# EAGLE design pd15 (EAGLE 7.2.0)
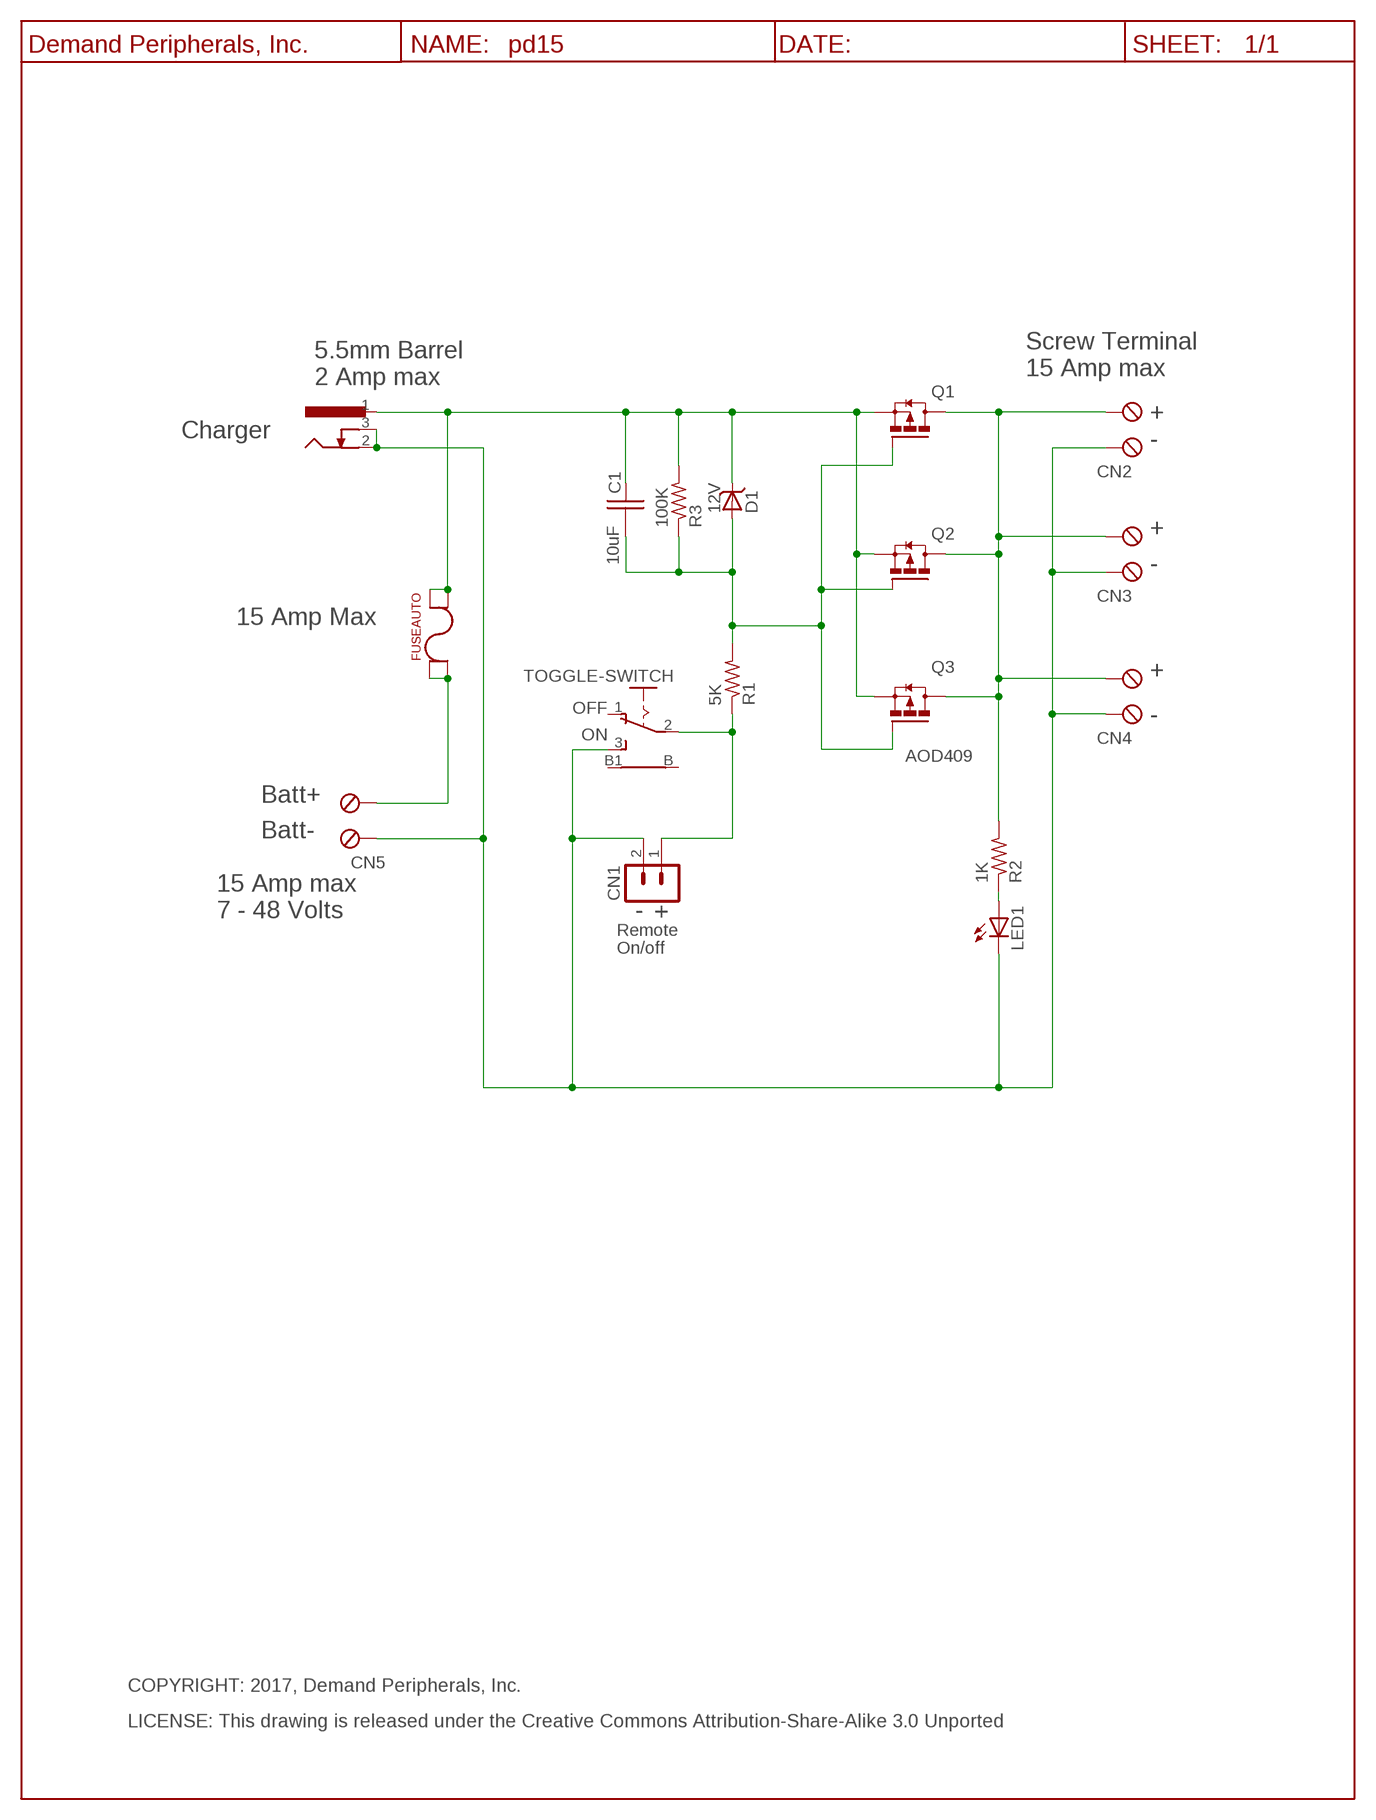
[diagram p0: schematic, sheet 1]

## Parts
C1  10uF  C10UF35V_C0805  [C0805]
CN1  HDR-2X1-LCK  [HDR-2X1]
CN2  TBLK-5.08-X2  [TBLK-5.08-X2]
CN3  TBLK-5.08-X2  [TBLK-5.08-X2]
CN4  TBLK-5.08-X2  [TBLK-5.08-X2]
CN5  TBLK-5.08-X2  [TBLK-5.08-X2]
D1  12V  BZT52C12  [SOD123]
FUSE  FUSEAUTO  FUSE-KS3557  [KS3557-10]
J1  Barrel-5.5mm  DC-BARREL-JACK--55MM  [DC-BARREL-JACK-55MM]
LED1  LED-5MM-GRN  [LED5MM]
Q1  FET_DPAK_P  AOD409  [DPACK_TO-252]
Q2  FET_DPAK_P  AOD409  [DPACK_TO-252]
Q3  AOD409  [DPACK_TO-252]
R1  5K  R4.99K_R0603  [R0603]
R2  1K  R1K_R0603  [R0603]
R3  100K  R100K_R0603  [R0603]
TOGGLE-SWITCH  B12EH  TOGGLE_SPDT_PC  [TOGGLE_SPDT_PC]
U$1  DP_FRAME_P  [LETTER_P]

## Nets
BATT+: CN5.2(KL1) FUSE.LS@1(LS) FUSE.LS@2(LS)
FUSE+: C1.1 D1.C FUSE.RS@3(RS) FUSE.RS@4(RS) J1.1 Q1.3(S) Q2.3(S) Q3.3(S) R3.2
GND: CN1.2 CN2.1(KL) CN3.1(KL) CN4.1(KL) CN5.1(KL) J1.2 J1.3 LED1.C TOGGLE-SWITCH.3(S)
N$1: LED1.A R2.1
N$10: C1.2 D1.A Q1.1(G) Q2.1(G) Q3.1(G) R1.2 R3.1
ON+: CN1.1 R1.1 TOGGLE-SWITCH.2(P)
V+: CN2.2(KL1) CN3.2(KL1) CN4.2(KL1) Q1.4(D) Q2.4(D) Q3.4(D) R2.2
Unconnected: TOGGLE-SWITCH.1(O) TOGGLE-SWITCH.B TOGGLE-SWITCH.B1

## Notes on the sheet
- Screw Terminal
- 5.5mm Barrel
- 15 Amp max
- 2 Amp max
- +
- Charger
- -
- +
- -
- 15 Amp Max
- +
- OFF
- -
- ON
- Batt+
- Batt-
- 15 Amp max
- 7 - 48 Volts | - | +
- Remote
- On/off
- COPYRIGHT: 2017, Demand Peripherals, Inc.
- LICENSE: This drawing is released under the Creative Commons Attribution-Share-Alike 3.0 Unported

## Library data of the parts
C1 = dpi-passive:C10UF35V_: 10 uF Capacitor, 35V, X6S; VENDOR: Digikey; VENDOR-PART-NUM: 490-10504-2-ND
CN1 = dpi-conn:HDR-2X1-LCK: 2x1 pin header with friction lock; VENDOR: Mouser; VENDOR-PART-NUM: 571-6404562
CN2-CN5 = dpi-conn:TBLK-5.08-X2: Terminal Block, 5.08mm, x2, screw terminals; VENDOR: Digikey; VENDOR-PART-NUM: ED2609-ND
D1 = dpi-diopto:BZT52C12: BZT52C12 12 volt Zener, 500 mW; VENDOR: Digikey; VENDOR-PART-NUM: BZT52C1213-FDICT-ND
FUSE = dpi-conn:FUSE-KS3557: Automotive fuse holder; VENDOR: Digikey; VENDOR-PART-NUM: 36-3557-10-ND
J1 = dpi-conn:DC-BARREL-JACK--55MM: 5.5 mm DC POWER JACK, CUI PJ-102AH; VENDOR: Digikey; VENDOR-PART-NUM: CP-102AH-ND
LED1 = dpi-diopto:LED-5MM-GRN: Green LED, 5 MM, through-hole; VENDOR: Digikey; VENDOR-PART-NUM: 160-1852-ND
Q1-Q3 = dpi-transic:AOD409: FET P-channel D-PAK w/diode; VENDOR: Digikey; VENDOR-PART-NUM: 785-1103-1-ND
R1 = dpi-passive:R4.99K_: 4.99K Resistor, 1%, 0.1 watt; VENDOR: Digikey; VENDOR-PART-NUM: 311-4.99KHRTR-ND
R2 = dpi-passive:R1K_: 1K Resistor, 1%, 0.1 watt; VENDOR: Digikey; VENDOR-PART-NUM: 311-1.00KHRTR-ND
R3 = dpi-passive:R100K_: 100K Resistor, 1%, 0.1 watt; VENDOR: Digikey; VENDOR-PART-NUM: 311-100KHRTR-ND
TOGGLE-SWITCH = dpi-swsens:TOGGLE_SPDT_PC: SPDT TOGGLE SWITCH; VENDOR: Digikey; VENDOR-PART-NUM: CKN1454-ND
U$1 = DP:DP_FRAME_P: Portrait/Letter Document Frame

## Board
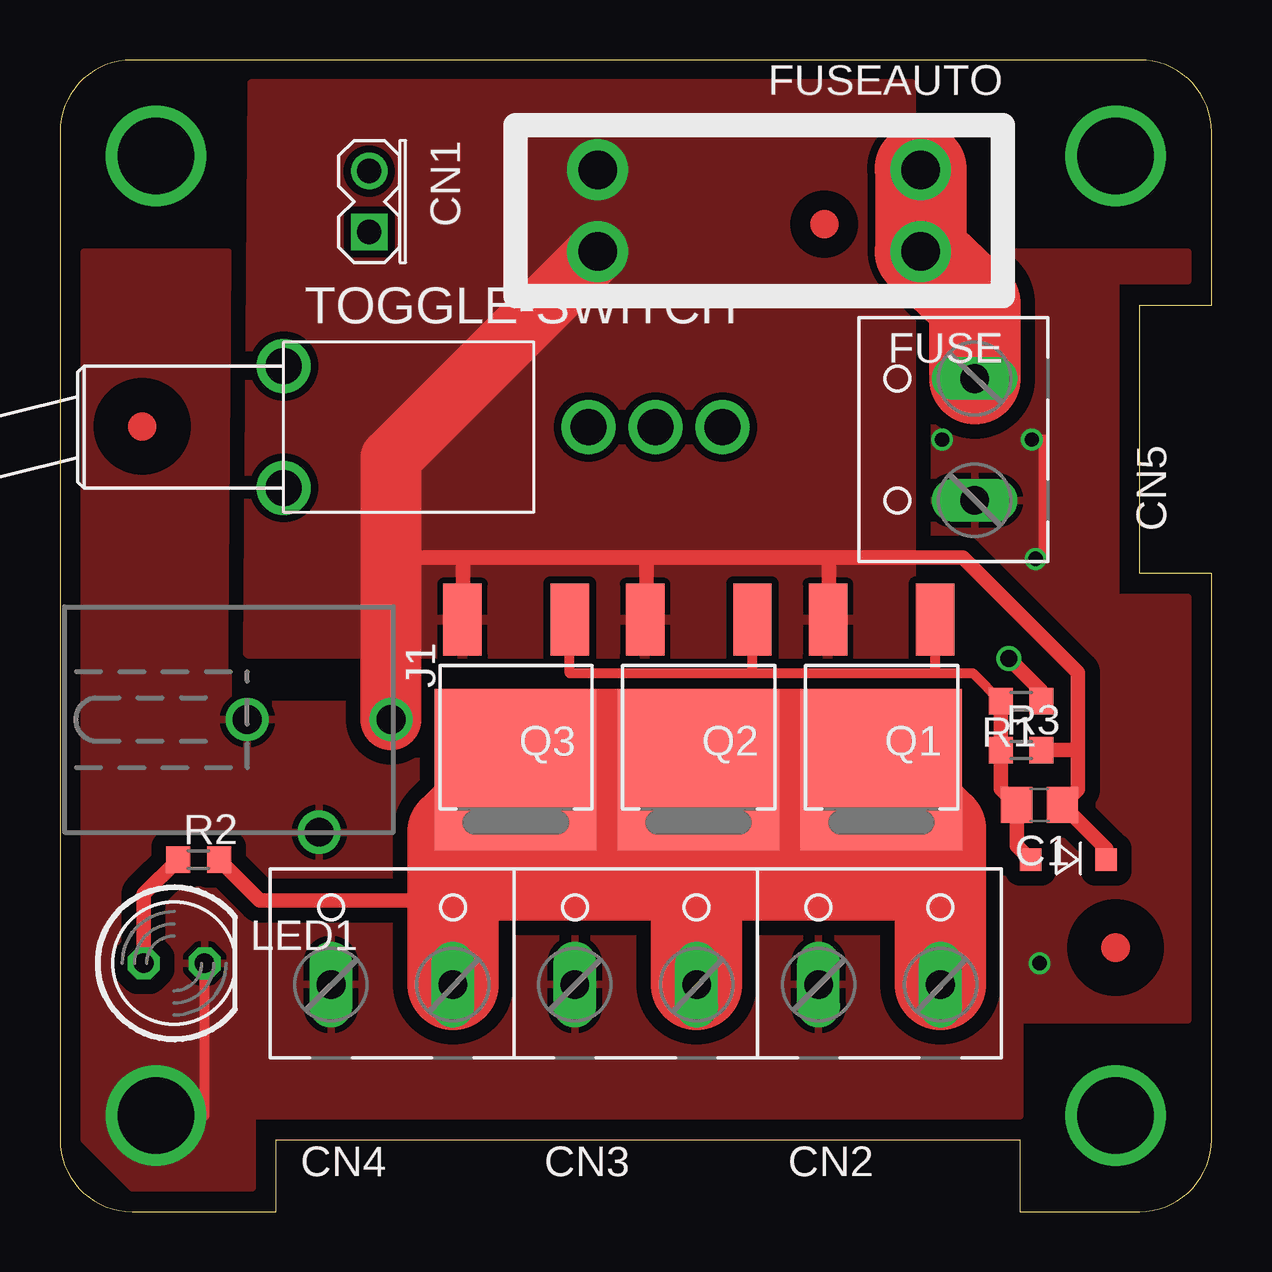
[diagram p1: board, top side]
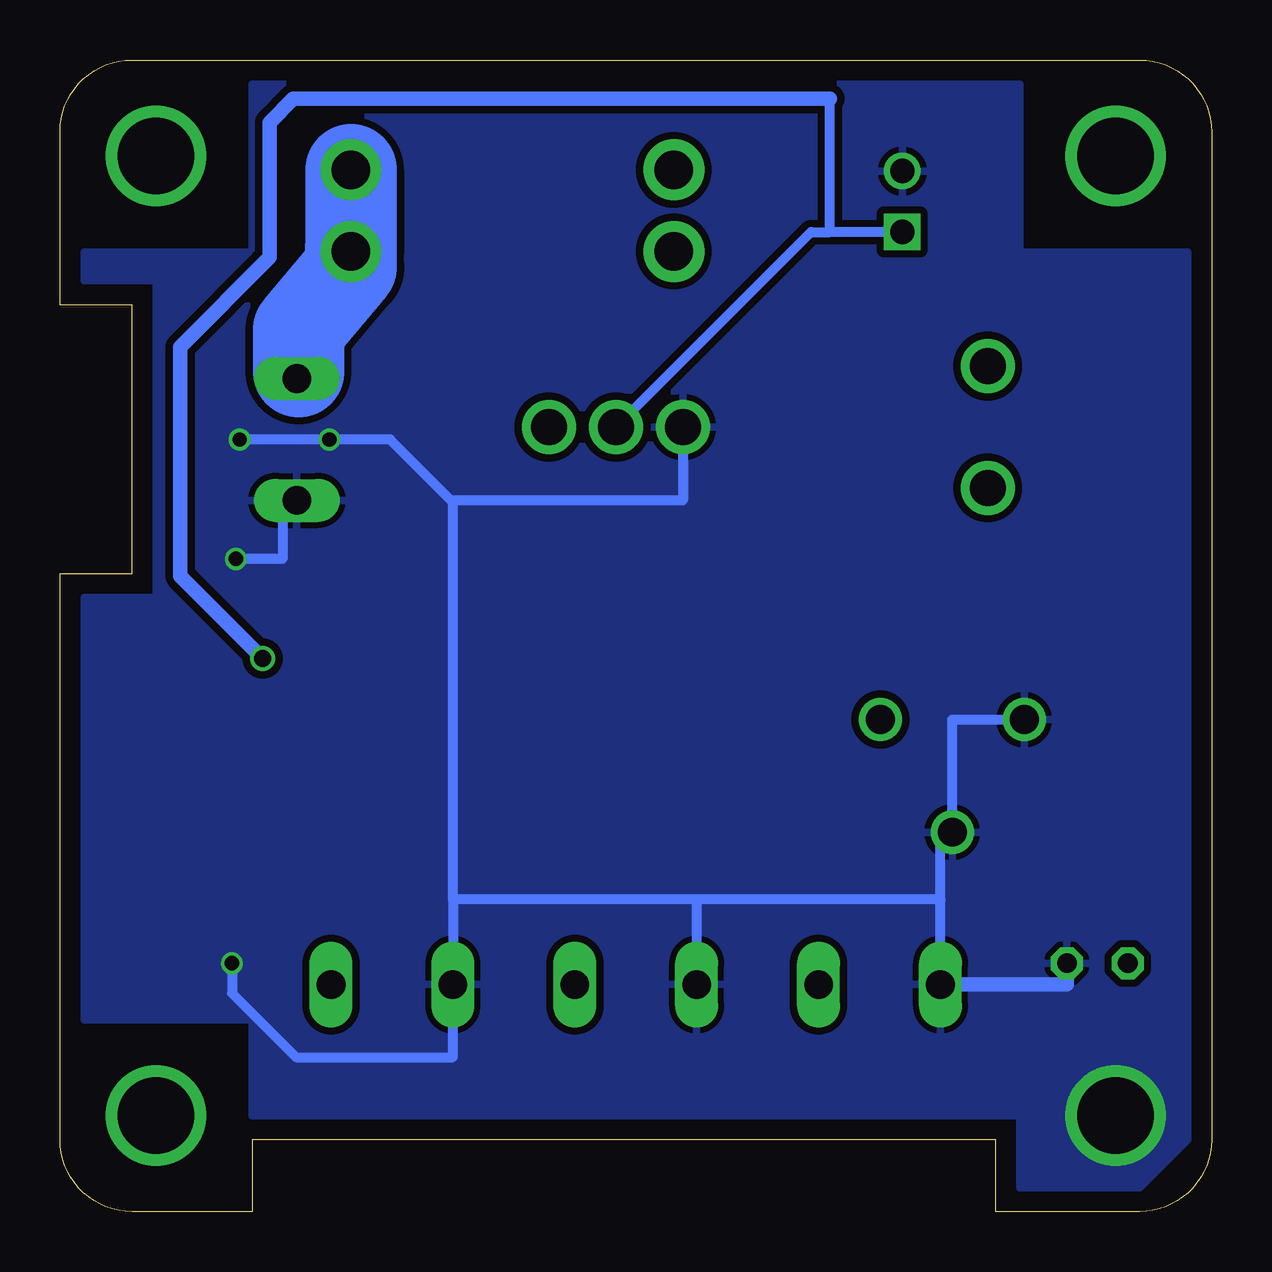
[diagram p2: board, bottom side, seen from below]

Size 48 x 48 mm. Coordinates in mm from the lower left corner, seen from the top.
Outline: 48,37.78 48,45 arc90 45,48 3,48 arc90 0,45 0,3 arc90 3,0 9,0 9,3 40,3 40,0 45,0 arc90 48,3 48,26.6 45,26.6 45,37.78 48,37.78
Copper layers (1*16): Top 0.035mm / dielectric 1.5mm / Bottom 0.035mm
Design rules "Fusion_eagle_rule_v1.1 *": minimum track width 6mil, minimum drill 12mil, track to track 12mil, track to pad 12mil, pad to pad 12mil, via to via 12mil, smd to smd 0mil, copper to edge 20mil, drill to drill 10mil, minimum pad ring 10mil, minimum via ring 6mil, stop-mask expansion 2mil, vias tented up to drill 10mil, thermal gap 10mil

### Footprints (pad centres in the part's own frame; a part is rotated, then mirrored left to right if it is on the bottom)
C0805 = smd 1.3 x 1.5: 1 -0.95,0; 2 0.95,0
HDR-2X1 = drill 1.016 square: 1 1.27,0 | drill 1.016: 2 -1.27,0
TBLK-5.08-X2 = drill 1.194 long: 1 -2.54,-0.127; 2 2.54,-0.127
SOD123 = smd 0.9 x 0.95: A 1.575,0; C -1.575,0
KS3557-10 = drill 1.6 pad 2.54: LS@1 -6.731,-1.702; LS@2 -6.731,1.702; RS@3 6.731,1.702; RS@4 6.731,-1.702
DC-BARREL-JACK-55MM = drill 1.2: 1 0,5.994; 2 0,0; 3 4.699,2.997
LED5MM = drill 0.813 octagon: A -1.27,0; C 1.27,0
DPACK_TO-252 = smd 1.6 x 2.997: 1 -2.261,-4.928; 3 2.21,-4.928 | smd 6.731 x 6.731: 4 0,1.321
R0603 = smd 1 x 1.1: 1 -0.85,0; 2 0.85,0
TOGGLE_SPDT_PC = drill 1.5 pad 1.676: 1 18.288,0; 2 15.494,0; 3 12.7,0 | drill 1.5 pad 1.778: B 0,-2.54; B1 0,2.54

### Placement (x,y rotation side)
C1  40.83,16.95 180 top
CN1  12.89,42.1 270 top
CN2  34.16,9.59 0 top
CN3  24,9.59 0 top
CN4  13.84,9.59 0 top
CN5  38,32.18 90 top
D1  42.03,14.67 180 top
FUSE  29.14,41.72 180 top
J1  7.81,20.51 270 top
LED1  4.76,10.35 0 top
Q1  34.22,19.75 180 top
Q2  26.6,19.75 180 top
Q3  18.98,19.75 180 top
R1  40.07,21.27 180 top
R2  5.78,14.67 0 top
R3  40.07,19.24 0 top
TOGGLE-SWITCH  9.33,32.7 0 top
U$1  -2.35,-2.35 0 top
U$3  [FIDUCIAL]  3.43,32.72 180 top
U$4  [FIDUCIAL]  31.86,41.16 180 top
U$8  [DPI-2]  27.98,42.82 0 bottom
U$12  [FIDUCIAL]  44,11 180 top

### Tracks (layer width: path | path; a pad name or v marks a point on that pad's centre or on a via)
BATT+
  Top 3.81: CN5.2 38.15,37.84 FUSE.LS@2
  Bottom 3.81: FUSE.LS@1 FUSE.LS@2
FUSE+
  Top 0.61: 32.05,27.26 24.45,27.26 | 24.45,27.26 16.81,27.26 | 16.81,27.26 13.8,27.26 | Q3.3 16.81,24.67 16.81,27.26 | Q2.3 24.45,24.67 24.45,27.26 | Q1.3 32.05,24.67 32.05,27.26 | 32.05,27.26 37.63,27.26 42.43,22.46 42.43,19.17 | 42.43,19.17 42.43,17.6 C1.1 43.61,15.12 D1.C | R3.2 42.36,19.24 42.43,19.17
  Top 2.54: J1.1 13.8,27.26 13.8,31.4 FUSE.RS@3
  pour Top: 8,47 7.83,23.26 35.49,23.26 35.49,47
GND  (via drill 0.6, 3.17)
  Top 0.406: v4,4 6.03,4 LED1.C | v40.66,27.2 41,27.2 41,32.18 v40.51,32.18
  Bottom 0.406: 31.62,29.64 31.7,29.64 34.24,32.18 v36.78,32.18 v40.51,32.18 | 31.62,13 CN2.1 31.62,6.44 38.16,6.44 40.83,9.1 v40.83,10.35 | 31.62,13 31.62,29.64 | CN4.1 11.3,13 | 21.46,13 31.62,13 | 21.46,13 CN3.1 | 11.3,13 21.46,13 | J1.2 10.8,20.51 J1.3 11.3,15.81 11.3,13 | TOGGLE-SWITCH.3 22.03,29.64 31.62,29.64 | 38.72,29.66 38.72,27.2 v40.66,27.2
  Bottom 0.61: LED1.C 6.03,9.46 CN4.1
  pour Top (isolate 0.61, rank 2): 1,40 7,40 7,21.14 36,21.14 36,40 47,40 47,38.8 44,38.8 44,25.6 47,25.6 47,8 40,8 40,4 8,4 8,1 3,1 1,3
  pour Bottom (isolate 0.305): 1,40 8,40 8,47 40,47 40,40 47,40 47,38.8 44,38.8 44,25.6 47,25.6 47,8 40,8 40,4 8,4 8,1 3,1 1,3
MOUNT  (via drill 3.17 pad 3.17)
  other vias: 44,44
N$1
  Top 0.61: R2.1 3.49,13.23 LED1.A
N$2
  Top 3.81: 35.89,39.99 35.89,43.44 35.86,43.47
N$3
  Bottom 3.81: 38.06,35.02 38.06,36.76 35.86,39.35 35.86,40.13 35.89,40.15
N$4  (via drill 3.17 pad 3.17)
  other vias: 4,44
N$5  (via drill 3.17 pad 3.17)
  other vias: 44,4
N$10
  Top 0.406: Q3.1 21.24,22.44 28.86,22.44 | 36.48,22.44 Q1.1 | 28.86,22.44 Q2.1 | 28.86,22.44 36.48,22.44 | 36.48,22.44 38.05,22.44 R1.2
  Top 0.61: D1.A 39.88,15.25 C1.2 39.22,17.61 R3.1 R1.2
ON+  (via drill 0.7)
  Top 0.61: R1.1 40.92,21.69 v39.56,23.05
  Bottom 0.406: CN1.1 15.9,40.83 | 15.9,40.83 15.9,46.38 | TOGGLE-SWITCH.2 16.7,40.83 15.9,40.83
  Bottom 0.61: 15.9,46.38 38.27,46.38 39.27,45.39 39.27,39.77 43,36.04 43,26.49 v39.56,23.05
V+
  Top 0.61: R2.2 8.33,12.96 16.38,12.96
  Top 3.81: CN2.2 36.7,15.95 Q1.4 Q2.4 | CN3.2 26.54,18.36 Q2.4 | CN4.2 16.38,12.96 16.38,15.82 Q3.4 Q2.4
(copper drawn outside any net)
  shapes: Top area x1

### Text on the board
tTest: (C) 2021, Demand Peripherals, Inc. | Rmt On | 15A Max | + | Rev 21A | PD15 | - | Q3 | Q2 | Q1 | R1 | Batt | R3 | C1 | R2 | LED | D1 | - | + | - | + | - | +